# Altium schematic sheet display.SchDoc: 4.3" LCD - touchscreen
size A3; Author: Francesco Sacchi <batt@develer.com>; Organization: Develer s.r.l.; Address1: via Mugellese 1/A; Address2: 50019 Campi Bisenzio; Address3: Firenze; Address4: ITALY; DocumentNumber: 2; Revision: A; SheetNumber: 2; SheetTotal: 2; Hw_rev: R1
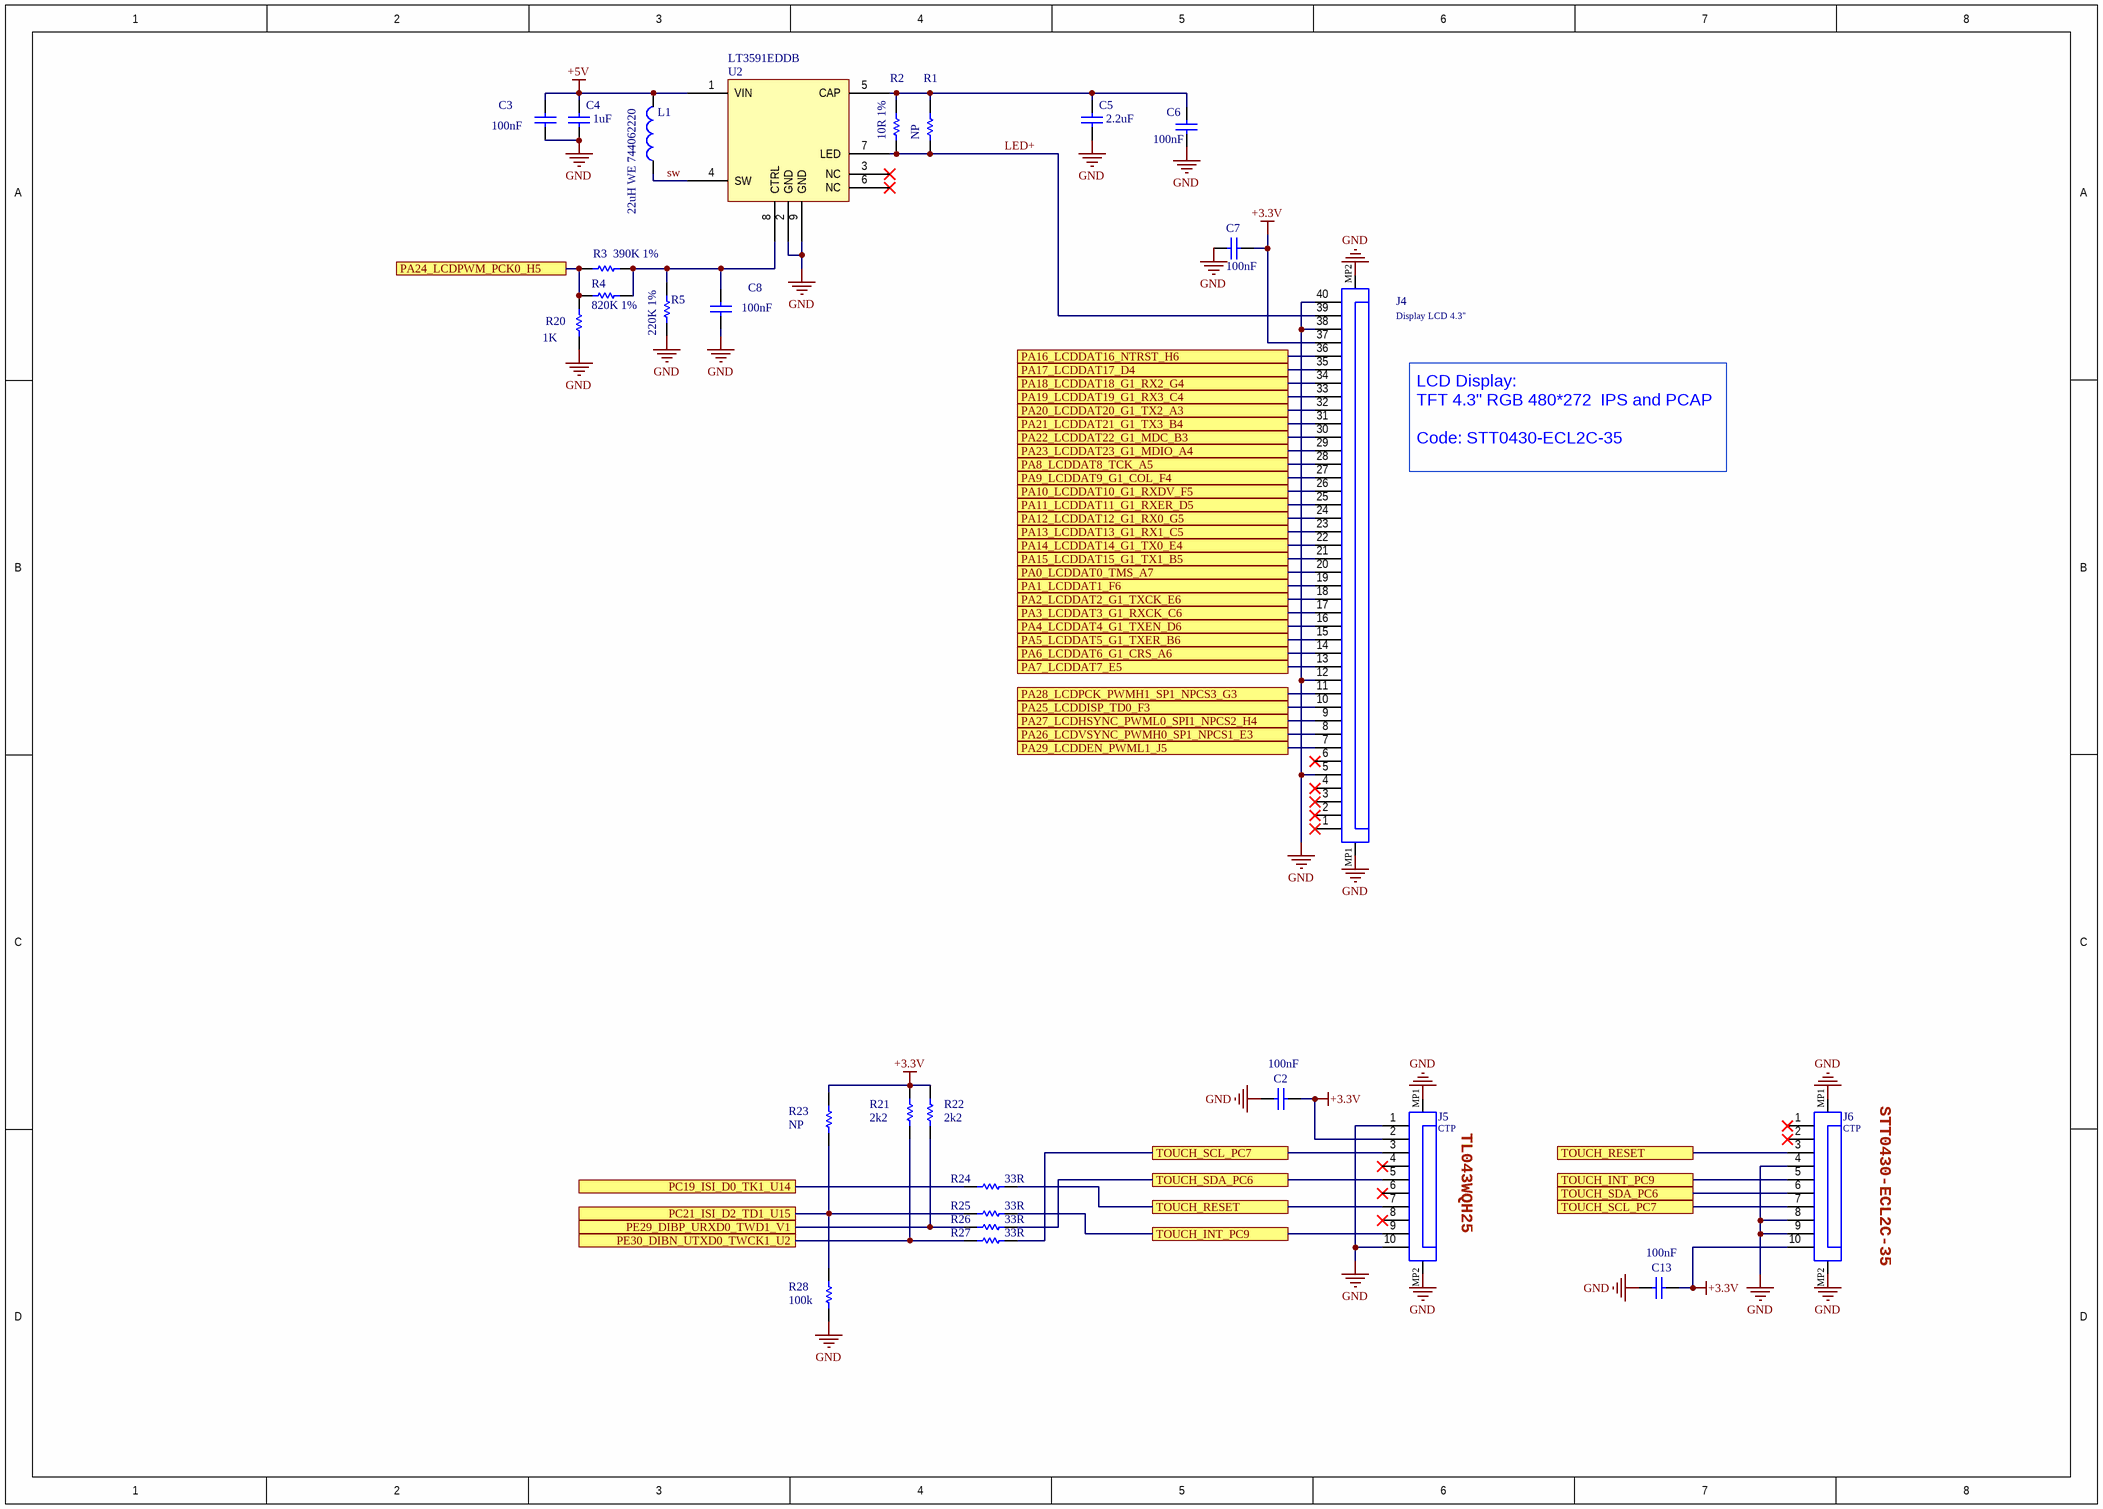
[diagram p0: display.SchDoc]

## Parts
C2  100nF  [0603_[1608]]
C3  100nF  [0603_[1608]]
C4  1uF  [0603_[1608]]
C5  2.2uF  [1210_[3225]]
C6  100nF  [0603_[1608]]
C7  100nF  [0603_[1608]]
C8  100nF  [0603_[1608]]
C13  100nF  [0603_[1608]]
J4  Display LCD 4.3''  [FCC-ZIF_40PIN_0.5MM_TOP_LOWPROFILE]
J5  CTP  [FCC-ZIF_10PIN_0.5MM_LOW_PROFILE]
J6  CTP  [FCC-ZIF_10PIN_0.5MM_LOW_PROFILE]
L1  22uH WE 744062220  [WE-TPC-6823-X]
R1  NP  [0603_[1608]]
R2  10R 1%  [0603_[1608]]
R3  390K 1%  [0603_[1608]]
R4  820K 1%  [0603_[1608]]
R5  220K 1%  [0603_[1608]]
R20  1K  [0603_[1608]]
R21  2k2  [0603_[1608]]
R22  2k2  [0603_[1608]]
R23  NP  [0603_[1608]]
R24  33R  [0603_[1608]]
R25  33R  [0603_[1608]]
R26  33R  [0603_[1608]]
R27  33R  [0603_[1608]]
R28  100k  [0603_[1608]]
U2  LT3591EDDB  [PQFN50P300X200X75_HS-9L]

## Ports
PA0_LCDDAT0_TMS_A7, PA1_LCDDAT1_F6, PA2_LCDDAT2_G1_TXCK_E6, PA3_LCDDAT3_G1_RXCK_C6, PA4_LCDDAT4_G1_TXEN_D6, PA5_LCDDAT5_G1_TXER_B6, PA6_LCDDAT6_G1_CRS_A6, PA7_LCDDAT7_E5, PA8_LCDDAT8_TCK_A5, PA9_LCDDAT9_G1_COL_F4, PA10_LCDDAT10_G1_RXDV_F5, PA11_LCDDAT11_G1_RXER_D5, PA12_LCDDAT12_G1_RX0_G5, PA13_LCDDAT13_G1_RX1_C5, PA14_LCDDAT14_G1_TX0_E4, PA15_LCDDAT15_G1_TX1_B5, PA16_LCDDAT16_NTRST_H6, PA17_LCDDAT17_D4, PA18_LCDDAT18_G1_RX2_G4, PA19_LCDDAT19_G1_RX3_C4, PA20_LCDDAT20_G1_TX2_A3, PA21_LCDDAT21_G1_TX3_B4, PA22_LCDDAT22_G1_MDC_B3, PA23_LCDDAT23_G1_MDIO_A4, PA24_LCDPWM_PCK0_H5, PA25_LCDDISP_TD0_F3, PA26_LCDVSYNC_PWMH0_SP1_NPCS1_E3, PA27_LCDHSYNC_PWML0_SPI1_NPCS2_H4, PA28_LCDPCK_PWMH1_SP1_NPCS3_G3, PA29_LCDDEN_PWML1_J5, PC19_ISI_D0_TK1_U14, PC21_ISI_D2_TD1_U15, PE29_DIBP_URXD0_TWD1_V1, PE30_DIBN_UTXD0_TWCK1_U2, TOUCH_INT_PC9, TOUCH_RESET, TOUCH_SCL_PC7, TOUCH_SDA_PC6

## Nets
+3.3V: C2.1 C7.1 C13.1 J4.37 J5.2 J6.10 R21.1 R22.1 R23.1
+5V: C3.2 C4.2 L1.2 U2.1(VIN)
GND: C2.2 C3.1 C4.1 C5.1 C6.1 C7.2 C8.1 C13.2 J4.5 J4.12 J4.38 J4.40 J4.MP1 J4.MP2 J5.1 J5.10 J5.MP1 J5.MP2 J6.4 J6.8 J6.9 J6.MP1 J6.MP2 R5.2 R20.2 R28.2 U2.2(GND) U2.9(GND)
LED+: J4.39 R1.1 R2.1 U2.7(LED)
PA0_LCDDAT0_TMS_A7: J4.20 ; port PA0_LCDDAT0_TMS_A7
PA1_LCDDAT1_F6: J4.19 ; port PA1_LCDDAT1_F6
PA2_LCDDAT2_G1_TXCK_E6: J4.18 ; port PA2_LCDDAT2_G1_TXCK_E6
PA3_LCDDAT3_G1_RXCK_C6: J4.17 ; port PA3_LCDDAT3_G1_RXCK_C6
PA4_LCDDAT4_G1_TXEN_D6: J4.16 ; port PA4_LCDDAT4_G1_TXEN_D6
PA5_LCDDAT5_G1_TXER_B6: J4.15 ; port PA5_LCDDAT5_G1_TXER_B6
PA6_LCDDAT6_G1_CRS_A6: J4.14 ; port PA6_LCDDAT6_G1_CRS_A6
PA7_LCDDAT7_E5: J4.13 ; port PA7_LCDDAT7_E5
PA8_LCDDAT8_TCK_A5: J4.28 ; port PA8_LCDDAT8_TCK_A5
PA9_LCDDAT9_G1_COL_F4: J4.27 ; port PA9_LCDDAT9_G1_COL_F4
PA10_LCDDAT10_G1_RXDV_F5: J4.26 ; port PA10_LCDDAT10_G1_RXDV_F5
PA11_LCDDAT11_G1_RXER_D5: J4.25 ; port PA11_LCDDAT11_G1_RXER_D5
PA12_LCDDAT12_G1_RX0_G5: J4.24 ; port PA12_LCDDAT12_G1_RX0_G5
PA13_LCDDAT13_G1_RX1_C5: J4.23 ; port PA13_LCDDAT13_G1_RX1_C5
PA14_LCDDAT14_G1_TX0_E4: J4.22 ; port PA14_LCDDAT14_G1_TX0_E4
PA15_LCDDAT15_G1_TX1_B5: J4.21 ; port PA15_LCDDAT15_G1_TX1_B5
PA16_LCDDAT16_NTRST_H6: J4.36 ; port PA16_LCDDAT16_NTRST_H6
PA17_LCDDAT17_D4: J4.35 ; port PA17_LCDDAT17_D4
PA18_LCDDAT18_G1_RX2_G4: J4.34 ; port PA18_LCDDAT18_G1_RX2_G4
PA19_LCDDAT19_G1_RX3_C4: J4.33 ; port PA19_LCDDAT19_G1_RX3_C4
PA20_LCDDAT20_G1_TX2_A3: J4.32 ; port PA20_LCDDAT20_G1_TX2_A3
PA21_LCDDAT21_G1_TX3_B4: J4.31 ; port PA21_LCDDAT21_G1_TX3_B4
PA22_LCDDAT22_G1_MDC_B3: J4.30 ; port PA22_LCDDAT22_G1_MDC_B3
PA23_LCDDAT23_G1_MDIO_A4: J4.29 ; port PA23_LCDDAT23_G1_MDIO_A4
PA24_LCDPWM_PCK0_H5: R3.2 R4.1 R20.1 ; port PA24_LCDPWM_PCK0_H5
PA25_LCDDISP_TD0_F3: J4.10 ; port PA25_LCDDISP_TD0_F3
PA26_LCDVSYNC_PWMH0_SP1_NPCS1_E3: J4.8 ; port PA26_LCDVSYNC_PWMH0_SP1_NPCS1_E3
PA27_LCDHSYNC_PWML0_SPI1_NPCS2_H4: J4.9 ; port PA27_LCDHSYNC_PWML0_SPI1_NPCS2_H4
PA28_LCDPCK_PWMH1_SP1_NPCS3_G3: J4.11 ; port PA28_LCDPCK_PWMH1_SP1_NPCS3_G3
PA29_LCDDEN_PWML1_J5: J4.7 ; port PA29_LCDDEN_PWML1_J5
PC19_ISI_D0_TK1_U14: R24.2 ; port PC19_ISI_D0_TK1_U14
PC21_ISI_D2_TD1_U15: R23.2 R25.2 R28.1 ; port PC21_ISI_D2_TD1_U15
PE29_DIBP_URXD0_TWD1_V1: R22.2 R26.2 ; port PE29_DIBP_URXD0_TWD1_V1
PE30_DIBN_UTXD0_TWCK1_U2: R21.2 R27.2 ; port PE30_DIBN_UTXD0_TWCK1_U2
sw: L1.1 U2.4(SW)
TOUCH_INT_PC9: J5.9 J6.5 R25.1 ; port TOUCH_INT_PC9
TOUCH_RESET: J5.7 J6.3 R24.1 ; port TOUCH_RESET
TOUCH_SCL_PC7: J5.3 J6.7 R27.1 ; port TOUCH_SCL_PC7
TOUCH_SDA_PC6: J5.5 J6.6 R26.1 ; port TOUCH_SDA_PC6
NetC5_2: C5.2 C6.2 R1.2 R2.2 U2.5(CAP)
NetC8_2: C8.2 R3.1 R4.2 R5.1 U2.8(CTRL)

Not connected (* = marked no-connect by the designer): J4 1* 2* 3* 4* 6*; J5 4* 6* 8*; J6 1* 2*; U2 3(NC)* 6(NC)*

## Notes on the sheet
- LCD Display:
  TFT 4.3" RGB 480*272  IPS and PCAP
  Code: STT0430-ECL2C-35
- (near J5) TL043WQH25
- (near J6) STT0430-ECL2C-35

## Library data of the parts
C2 C13 = Cap: Ceramic X7R 10V; Value: 10nF; Published: 8-Jun-2000; Revision: July-2002: Re-released for DXP Platform.; Publisher: Altium Limited
C3 C6 C8 = Cap: Ceramic X7R 50V; Value: 10nF; Published: 8-Jun-2000; Revision: July-2002: Re-released for DXP Platform.; Publisher: Altium Limited
C4 = Cap: Ceramic X7R, X5R 16V; Value: 10nF; Published: 8-Jun-2000; Revision: July-2002: Re-released for DXP Platform.; Publisher: Altium Limited
C5 = Cap: Ceramic X7R, X5R 50V; Value: 10nF; Published: 8-Jun-2000; Revision: July-2002: Re-released for DXP Platform.; Publisher: Altium Limited
C7 = Cap: Ceramic X5R 6.3V, 10V; Value: 10nF; Published: 8-Jun-2000; Revision: July-2002: Re-released for DXP Platform.; Publisher: Altium Limited
J4 = FPC-ZIF_40PIN_1MM: Connectors, FPC, SMT ZIF, Low Profile, Horizontal, Top Contact, pitch 0.5 mm, 40 pins (WE 687140183622); Rated Current: 0.4 A; Contact Resistance: 30 mOhm; Withstanding Voltage: 250 VAC; Working Voltage: 50 VAC; Pin Number: 40; Pitch: 0.5 mm; ComponentLink1Description: Manufacturer; ComponentLink1URL: http://www.we-online.de; ComponentLink2Description: Datasheet; ComponentLink2URL: https://katalog.we-online.de/em/datasheet/687140183622.pdf; Part Number: 687140183622; Published Date: August 2018; Publisher: Wurth Elektronik; Operating Temperature: -25 to 85 degC; Packaging: Tape and Reel; Mounting Technology: SMT; Orientation: Horizontal; Contact Design: Top Contact
J5 = FPC-ZIF_10PIN_0.5MM: Connectors, FPC, SMT ZIF, Low Profile, Horizontal, Top Contact, pitch 0.5 mm, 10 pins (WE 687110183622); Part Number: 687110183722; Rated Current: 0.4 A; Contact Resistance: 30 mOhm; Withstanding Voltage: 250 VAC; Working Voltage: 50 VAC; Pin Number: 10; Pitch: 0.5 mm; Contact Design: Bottom Contact; ComponentLink1Description: Manufacturer; ComponentLink1URL: http://www.we-online.de; ComponentLink2Description: Datasheet; ComponentLink2URL: https://katalog.we-online.de/em/datasheet/687110183722.pdf; Published Date: August 2018; Publisher: Wurth Elektronik; Operating Temperature: -25 to 85 degC; Packaging: Tape and Reel; Mounting Technology: SMT; Orientation: Horizontal
J6 = FPC-ZIF_10PIN_0.5MM: Connectors, FPC, SMT ZIF, Low Profile, Horizontal, BOT Contact, pitch 0.5 mm, 10 pins (WE ); Part Number: 687110183722; Rated Current: 0.4 A; Contact Resistance: 30 mOhm; Withstanding Voltage: 250 VAC; Working Voltage: 50 VAC; Pin Number: 10; Pitch: 0.5 mm; Contact Design: Bottom Contact; ComponentLink1Description: Manufacturer; ComponentLink1URL: http://www.we-online.de; ComponentLink2Description: Datasheet; ComponentLink2URL: https://katalog.we-online.de/em/datasheet/687110183722.pdf; Published Date: August 2018; Publisher: Wurth Elektronik; Operating Temperature: -25 to 85 degC; Packaging: Tape and Reel; Mounting Technology: SMT; Orientation: Horizontal
L1 = Inductor: Power Inductor
R1 R2 R21-R23 R28 = Res1: Resistor 0.125W; Value: 1K; Published: 8-Jun-2000; Revision: July-2002: Re-released for DXP Platform.; Publisher: Altium Limited
R3-R5 R24-R27 = Res1: Resistor; Value: 1K; Published: 8-Jun-2000; Revision: July-2002: Re-released for DXP Platform.; Publisher: Altium Limited
R20 = Res1: Resistor; Published: 8-Jun-2000; Revision: July-2002: Re-released for DXP Platform.; Publisher: Altium Limited; Value: 1K
U2 = LT3591: White LED Driver with Integrated Schottky